# Altium schematic sheet Esquematico_Fonte.SchDoc
size A4
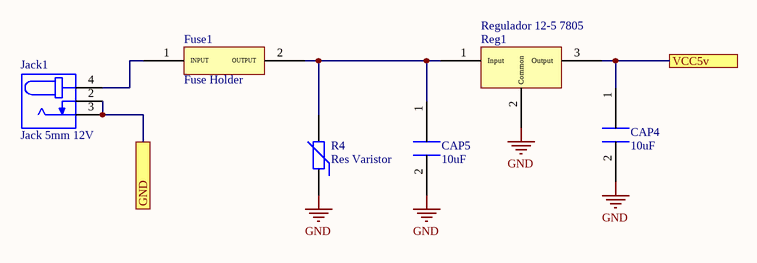
[diagram p0: Esquematico_Fonte.SchDoc]

## Parts
CAP4  10uF  [Capacitor Eletro]
CAP5  10uF  [Capacitor Eletro]
Fuse1  Fuse Holder  [Fuse Holder]
Jack1  Jack 5mm 12V  [Jack 5mm]
R4  Res Varistor  [6-0805_N]
Reg1  Regulador 12-5 7805  [Regulador 12-5 7805]

## Ports
GND, VCC5v

## Nets
GND: CAP4.2 CAP5.2 R4.1 Reg1.2(Common)
GND: Jack1.2 Jack1.3 ; port GND  [a separate net that carries the same name]
VCC5v: CAP4.1 Reg1.3(Output) ; port VCC5v
NetCAP5_1: CAP5.1 Fuse1.2(OUTPUT) R4.2 Reg1.1(Input)
NetFuse1_1: Fuse1.1(INPUT) Jack1.4

## Library data of the parts
CAP4 CAP5 = 33pF: Condensador
R4 = Res Varistor: Varistor (Voltage-Sensitive Resistor); Published: 24-Mar-1999; LatestRevisionDate: 29-May-2009; LatestRevisionNote: IPC-7351 Footprint Added.; PackageVersion: Mar-2003; PackageReference: 6-0805; Publisher: Altium Limited; PackageDescription: Chip Resistor 0805 Case Size; Code_IPC: RESC2012